# EAGLE design AdaptadorAcceso (EAGLE 9.5.2)
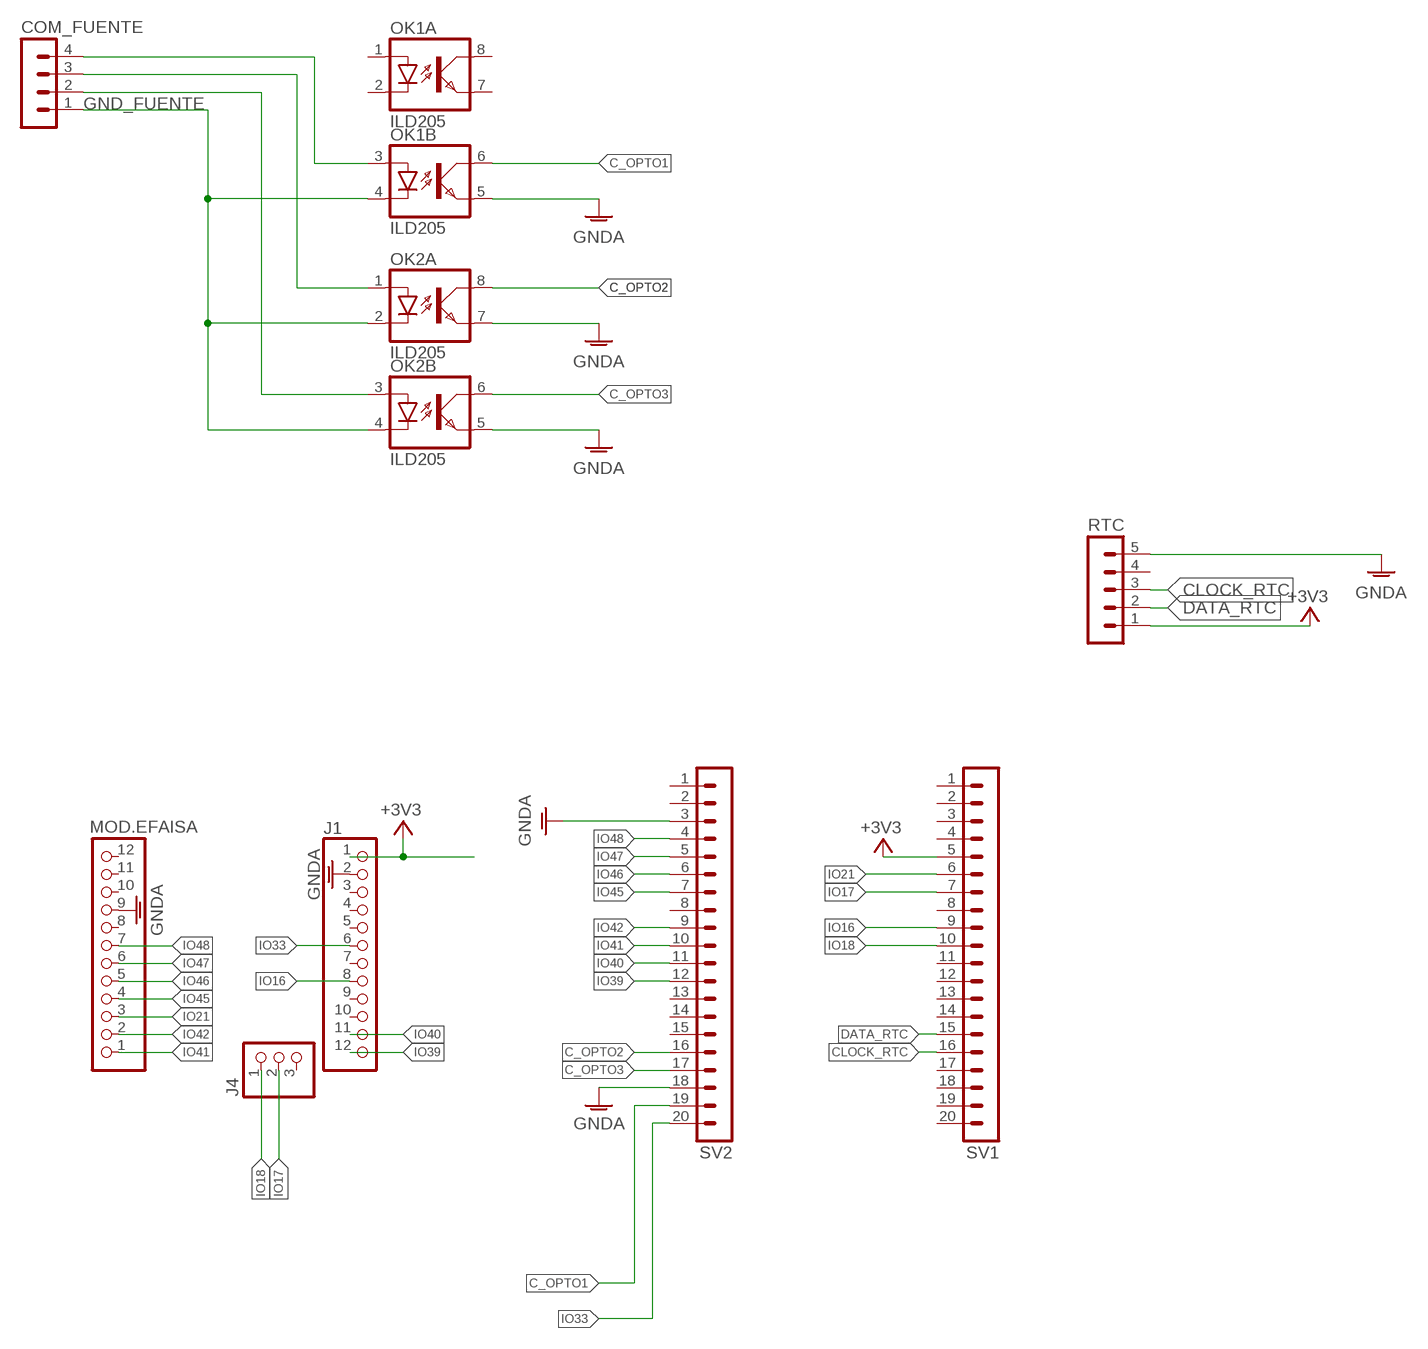
[diagram p0: schematic, sheet 1]

## Parts
COM_FUENTE  MA04-1  [MA04-1]
J1  PINHD-1X12  [1X12]
J4  PINHD-1X3  [1X03]
MOD.EFAISA  PINHD-1X12  [1X12]
OK1  ILD205  [SOIC08]
OK2  ILD205  [SOIC08]
RTC  MA05-1  [MA05-1]
SV1  MA20-1L  [MA20-1L]
SV2  MA20-1L  [MA20-1L]

## Nets
+3V3 [normal]: J1.1 RTC.1 SV1.5
C_OPTO1 [fina]: OK1.6(B:COL) SV2.19
C_OPTO2 [fina]: OK2.8(A:COL) SV2.16
C_OPTO3 [fina]: OK2.6(B:COL) SV2.17
CLOCK_RTC [fina]: RTC.3 SV1.16
DATA_RTC [fina]: RTC.2 SV1.15
GND_FUENTE [fina]: COM_FUENTE.1 OK1.4(B:C) OK2.2(A:C) OK2.4(B:C)
GNDA [normal]: J1.2 MOD.EFAISA.9 OK1.5(B:EMIT) OK2.5(B:EMIT) OK2.7(A:EMIT) RTC.5 SV2.3 SV2.18
IO16 [fina]: J1.8 SV1.9
IO17 [fina]: J4.2 SV1.7
IO18 [fina]: J4.1 SV1.10
IO21 [fina]: MOD.EFAISA.3 SV1.6
IO33 [fina]: J1.6 SV2.20
IO39 [fina]: J1.12 SV2.12
IO40 [fina]: J1.11 SV2.11
IO41 [fina]: MOD.EFAISA.1 SV2.10
IO42 [fina]: MOD.EFAISA.2 SV2.9
IO45 [fina]: MOD.EFAISA.4 SV2.7
IO46 [fina]: MOD.EFAISA.5 SV2.6
IO47 [fina]: MOD.EFAISA.6 SV2.5
IO48 [fina]: MOD.EFAISA.7 SV2.4
N$1 [fina]: COM_FUENTE.4 OK1.3(B:A)
N$2 [fina]: COM_FUENTE.3 OK2.1(A:A)
N$3 [fina]: COM_FUENTE.2 OK2.3(B:A)
Unconnected: J1.3 J1.4 J1.5 J1.7 J1.9 J1.10 J4.3 MOD.EFAISA.8 MOD.EFAISA.10 MOD.EFAISA.11 MOD.EFAISA.12 OK1.1(A:A) OK1.2(A:C) OK1.7(A:EMIT) OK1.8(A:COL) RTC.4 SV1.1 SV1.2 SV1.3 SV1.4 SV1.8 SV1.11 SV1.12 SV1.13 SV1.14 SV1.17 SV1.18 SV1.19 SV1.20 SV2.1 SV2.2 SV2.8 SV2.13 SV2.14 SV2.15

## Library data of the parts
COM_FUENTE = con-lstb:MA04-1: PIN HEADER; OC_FARNELL: unknown; OC_NEWARK: unknown
J1 MOD.EFAISA = pinhead:PINHD-1X12: PIN HEADER
J4 = pinhead:PINHD-1X3: PIN HEADER
OK1 OK2 = optocoupler:ILD2*: Siemens ILD205/206/207/211/213/217 DUAL PHOTOTRANSISTOR SMALL OUTLINE SURFACE MOUNT OPTOCOUPLER Source: 153385-da-01-en-Optocoupler_ILD205-T.pdf; MF: VISHAY/TELEFUNKEN; MPN: ILD205T; OC_FARNELL: 1469512; OC_NEWARK: 20H8678
RTC = con-lstb:MA05-1: PIN HEADER; OC_FARNELL: unknown; OC_NEWARK: unknown
SV1 SV2 = con-lstb:MA20-1L: PIN HEADER; OC_FARNELL: unknown; OC_NEWARK: unknown

## Net classes
0 gruesa: width 0.9 mm, drill 0.508 mm, clearance 0.559 mm
1 normal: width 0.8 mm, drill 0.508 mm, clearance 0.559 mm
2 fina: width 0.5 mm, drill 0.508 mm, clearance 0.381 mm
3 Ultra Fina: width 0.4 mm, drill 0.508 mm, clearance 0.254 mm

## Board
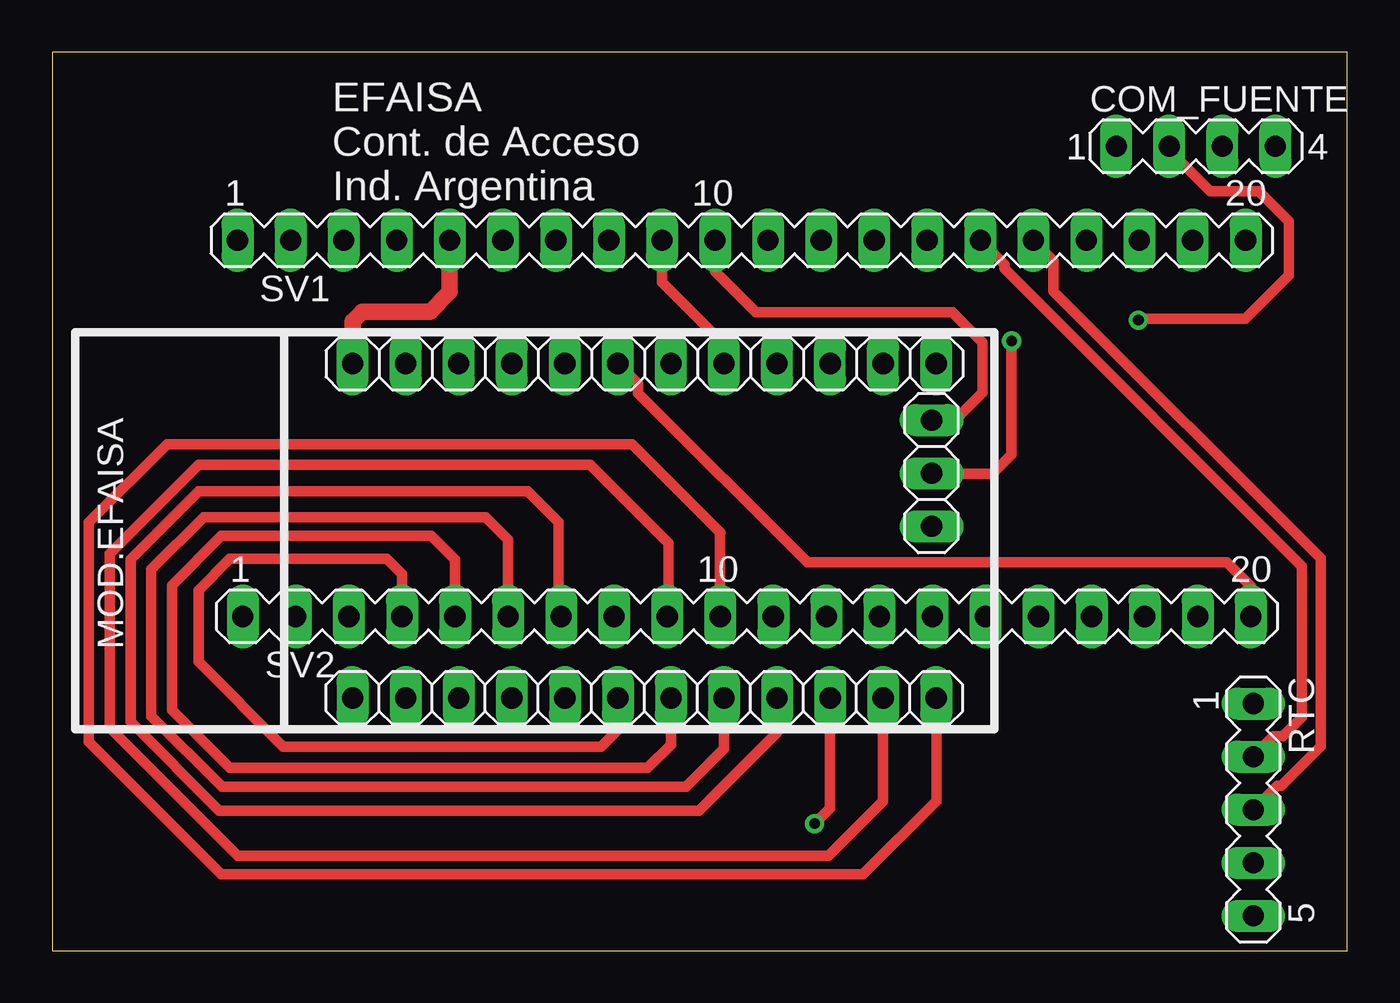
[diagram p1: board, top side]
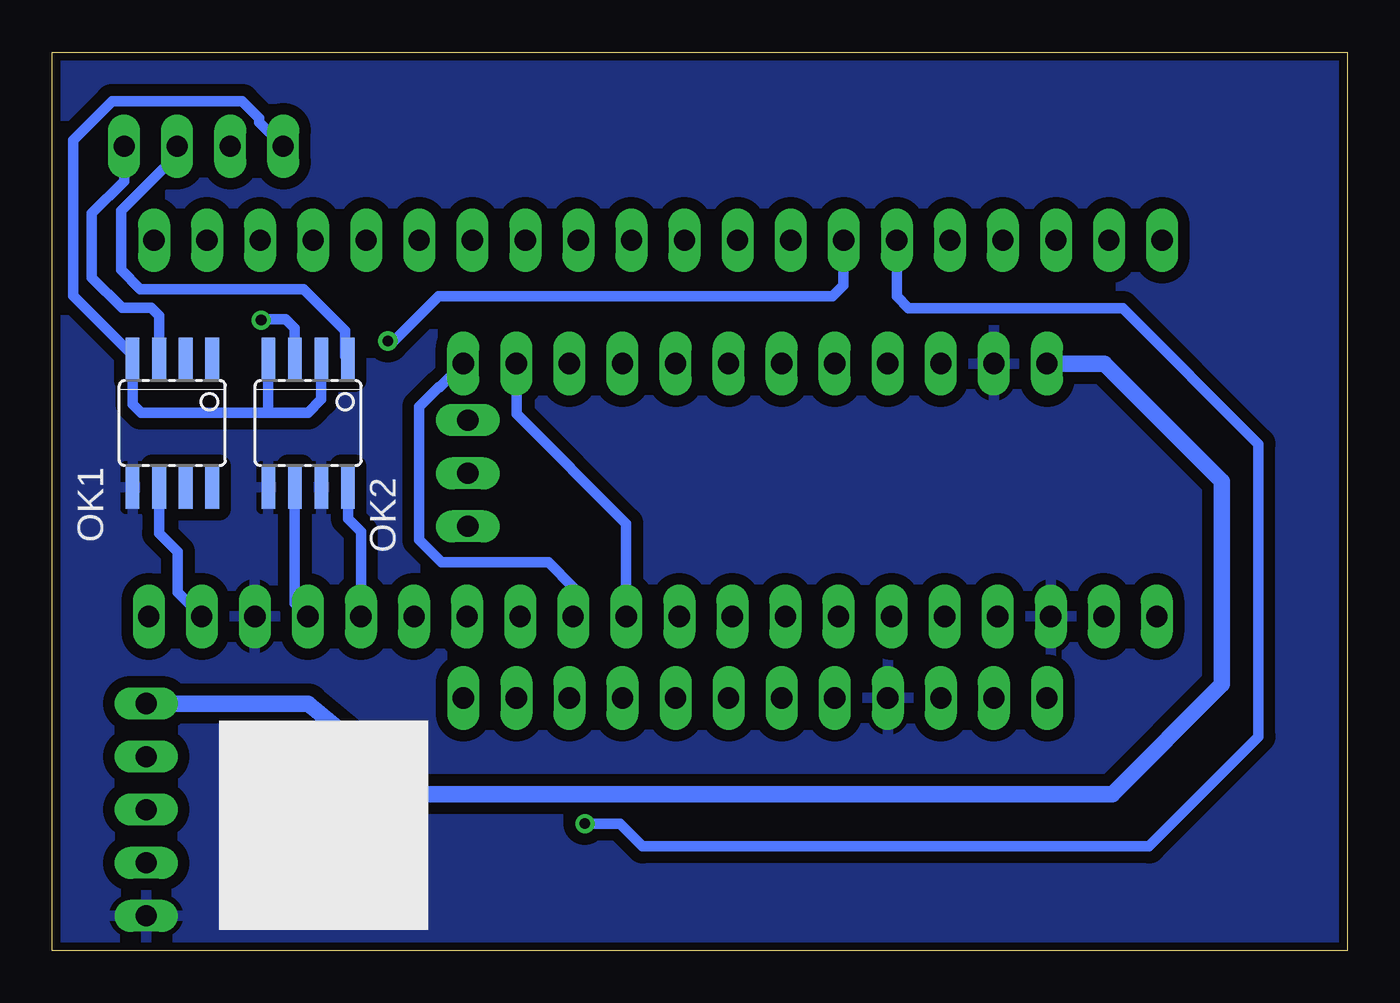
[diagram p2: board, bottom side, seen from below]

Size 62 x 43 mm. Coordinates in mm from the lower left corner, seen from the top.
Outline: 0,0 62,0 62,43 0,43 0,0
Copper layers (1*16): Top 0.035mm / dielectric 1.5mm / Bottom 0.035mm
Design rules "default *": minimum track width 0.3mm, minimum drill 20mil, track to track 0.4mm, track to pad 0.25mm, pad to pad 0.25mm, via to via 0.25mm, smd to smd 8mil, copper to edge 0.4mm, drill to drill 8mil, minimum pad ring 10mil, minimum via ring 8mil, stop-mask expansion 4mil, vias tented up to drill 0mil, thermal gap 10mil

### Footprints (pad centres in the part's own frame; a part is rotated, then mirrored left to right if it is on the bottom)
MA04-1 = drill 1.016 long: 1 -3.81,0; 2 -1.27,0; 3 1.27,0; 4 3.81,0
1X12 = drill 1.016 long: 1 -13.97,0; 2 -11.43,0; 3 -8.89,0; 4 -6.35,0; 5 -3.81,0; 6 -1.27,0; 7 1.27,0; 8 3.81,0; 9 6.35,0; 10 8.89,0; 11 11.43,0; 12 13.97,0
1X03 = drill 1.016 long: 1 -2.54,0; 2 0,0; 3 2.54,0
SOIC08 = smd 0.66 x 2.032: 1 -1.905,-3.073; 2 -0.635,-3.073; 3 0.635,-3.073; 4 1.905,-3.073; 5 1.905,3.073; 6 0.635,3.073; 7 -0.635,3.073; 8 -1.905,3.073
MA05-1 = drill 1.016 long: 1 -5.08,0; 2 -2.54,0; 3 0,0; 4 2.54,0; 5 5.08,0
MA20-1L = drill 1.016 long: 1 24.13,0; 2 21.59,0; 3 19.05,0; 4 16.51,0; 5 13.97,0; 6 11.43,0; 7 8.89,0; 8 6.35,0; 9 3.81,0; 10 1.27,0; 11 -1.27,0; 12 -3.81,0; 13 -6.35,0; 14 -8.89,0; 15 -11.43,0; 16 -13.97,0; 17 -16.51,0; 18 -19.05,0; 19 -21.59,0; 20 -24.13,0

### Placement (x,y rotation side)
COM_FUENTE  54.75,38.5 0 top
J1  28.35,28.1 0 top
J4  42.1,22.85 270 top
MOD.EFAISA  28.35,12.1 180 top
OK1  56.25,25.25 180 bottom
OK2  49.75,25.25 180 bottom
RTC  57.5,6.75 270 top
SV1  33,34 180 top
SV2  33.25,16 180 top

### Tracks (layer width: path | path; a pad name or v marks a point on that pad's centre or on a via)
+3V3
  Top 0.8: J1.1 14.38,30.13 14.83,30.58 18.08,30.58 19.03,31.53 SV1.5
  Bottom 0.8: J1.1 11.63,28.1 6,22.47 6,12.75 11.25,7.5 44.5,7.5 49.74,11.83 RTC.1
C_OPTO1
  Bottom 0.5: SV2.19 55.99,17.15 55.99,19.09 56.88,19.99 OK1.6
C_OPTO2
  Bottom 0.5: SV2.16 47.22,20.05 47.84,20.68 OK2.8
C_OPTO3
  Bottom 0.5: OK2.6 50.38,16.62 SV2.17
CLOCK_RTC
  Top 0.5: SV1.16 47.94,33.03 47.94,31.57 60.73,18.78 60.73,9.79 58.84,7.9 58.65,7.9 RTC.3
DATA_RTC
  Top 0.5: SV1.15 45.58,32.85 45.58,32.66 59.83,18.41 59.83,11.18 58.91,10.26 58.47,10.26 RTC.2
GND_FUENTE
  Bottom 0.5: OK2.2 49.12,26.39 49.75,25.75 51.66,25.75 | OK2.4 51.66,25.75 | 51.66,25.75 57.75,25.75 58.16,26.16 OK1.4 58.16,28.5 61,31.34 61,38.79 59.14,40.66 52.9,40.66 52.09,39.84 52.09,39.65 COM_FUENTE.1
GNDA
  pour Bottom: -0.75,43.5 62.5,43.5 62.5,-1 -0.75,-1
IO16
  Top 0.5: SV1.9 29.19,32 32.16,29.03 J1.8
IO17  (via drill 0.51)
  Top 0.5: J4.2 42.13,22.82 45.01,22.82 45.93,23.74 v45.93,29.18
  Bottom 0.5: SV1.7 24.11,31.86 24.64,31.33 43.51,31.33 45.66,29.18 v45.93,29.18
IO18
  Top 0.5: SV1.10 31.73,32.52 33.68,30.57 43.09,30.57 44.53,29.13 44.53,26.7 43.23,25.39 J4.1
IO21  (via drill 0.51)
  Top 0.5: v36.5,6.08 37.24,6.82 MOD.EFAISA.3
  Bottom 0.5: SV1.6 21.57,31.32 21,30.75 10.75,30.75 4.25,24.25 4.25,10.25 9.5,5 33.73,5 34.82,6.08 v36.5,6.08
IO33
  Top 0.5: J1.6 28.05,27.13 28.05,26.69 36.15,18.58 56.24,18.58 57.38,17.44 SV2.20
IO39
  Bottom 0.5: J1.12 43.46,26.96 43.51,26.96 44.43,26.04 44.43,19.66 43.35,18.58 38.25,18.58 37.06,17.39 SV2.12
IO40
  Bottom 0.5: SV2.11 34.52,20.44 39.78,25.7 J1.11
IO41
  Top 0.5: SV2.10 31.98,19.98 32,20 27.75,24.25 5.5,24.25 1.75,20.5 1.75,10 8.1,3.65 38.81,3.65 42.32,7.16 MOD.EFAISA.1
IO42
  Top 0.5: SV2.9 29.5,16.06 29.5,19.5 25.75,23.25 7,23.25 2.75,19 2.75,10.68 8.88,4.55 37.17,4.55 39.78,7.16 MOD.EFAISA.2
IO45
  Top 0.5: SV2.7 24.25,16.11 24.25,20.5 22.75,22 7.02,22 3.75,18.73 3.75,10.95 8,6.7 30.97,6.7 34.7,10.43 MOD.EFAISA.4
IO46
  Top 0.5: SV2.6 21.82,19.68 20.75,20.75 7.25,20.75 4.75,18.25 4.75,11.23 8.13,7.85 30.35,7.85 32.16,9.66 MOD.EFAISA.5
IO47
  Top 0.5: SV2.5 19.28,18.72 18.15,19.85 8.1,19.85 5.75,17.5 5.75,11.5 8.5,8.75 28.5,8.75 29.62,9.87 MOD.EFAISA.6
IO48
  Top 0.5: SV2.4 16.74,18.01 16,18.75 8.5,18.75 7,17.25 7,13.83 11.07,9.77 26.27,9.77 27.08,10.58 MOD.EFAISA.7
N$1
  Bottom 0.5: COM_FUENTE.4 58.56,36.83 60.1,35.28 60.1,32.22 58.65,30.77 57.27,30.77 56.88,30.39 OK1.3
N$2
  Bottom 0.5: OK2.1 47.98,28.45 47.98,29.67 49.97,31.67 57.78,31.67 58.7,32.59 58.7,35.41 56.02,38.09 COM_FUENTE.3
N$3  (via drill 0.51)
  Top 0.5: COM_FUENTE.2 53.48,38.31 55.44,36.34 57.77,36.34 59.2,34.91 59.2,32.34 57.11,30.25 52.07,30.25 v52,30.18
  Bottom 0.5: v52,30.18 51.96,30.22 50.81,30.22 50.38,29.79 OK2.3

### Text on the board
tPlace: EFAISA / Cont. de Acceso / Ind. Argentina